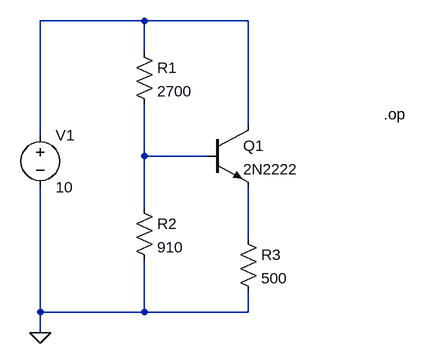
[diagram p0: schematic current_source.asc]
current_source.asc, the LTspice schematic file:
Version 4
SHEET 1 880 680
WIRE 320 16 160 16
WIRE 480 16 320 16
WIRE 320 64 320 16
WIRE 480 176 480 16
WIRE 160 192 160 16
WIRE 320 224 320 144
WIRE 416 224 320 224
WIRE 320 304 320 224
WIRE 480 352 480 272
WIRE 160 464 160 272
WIRE 320 464 320 384
WIRE 320 464 160 464
WIRE 480 464 480 432
WIRE 480 464 320 464
WIRE 160 496 160 464
FLAG 160 496 0
SYMBOL voltage 160 176 R0
WINDOW 123 0 0 Left 2
WINDOW 39 0 0 Left 2
SYMATTR InstName V1
SYMATTR Value 10
SYMBOL res 304 48 R0
SYMATTR InstName R1
SYMATTR Value 2700
SYMBOL res 304 288 R0
SYMATTR InstName R2
SYMATTR Value 910
SYMBOL res 464 336 R0
SYMATTR InstName R3
SYMATTR Value 500
SYMBOL npn 416 176 R0
SYMATTR InstName Q1
SYMATTR Value 2N2222
TEXT 688 160 Left 2 !.op

The netlist it stands for:
* current_source.asc
V1 N001 0 10
R1 N001 N002 2700
R2 N002 0 910
R3 N003 0 500
Q1 N001 N002 N003 0 2N2222
.model NPN NPN
.model PNP PNP
.lib standard.bjt
.op
.backanno
.end